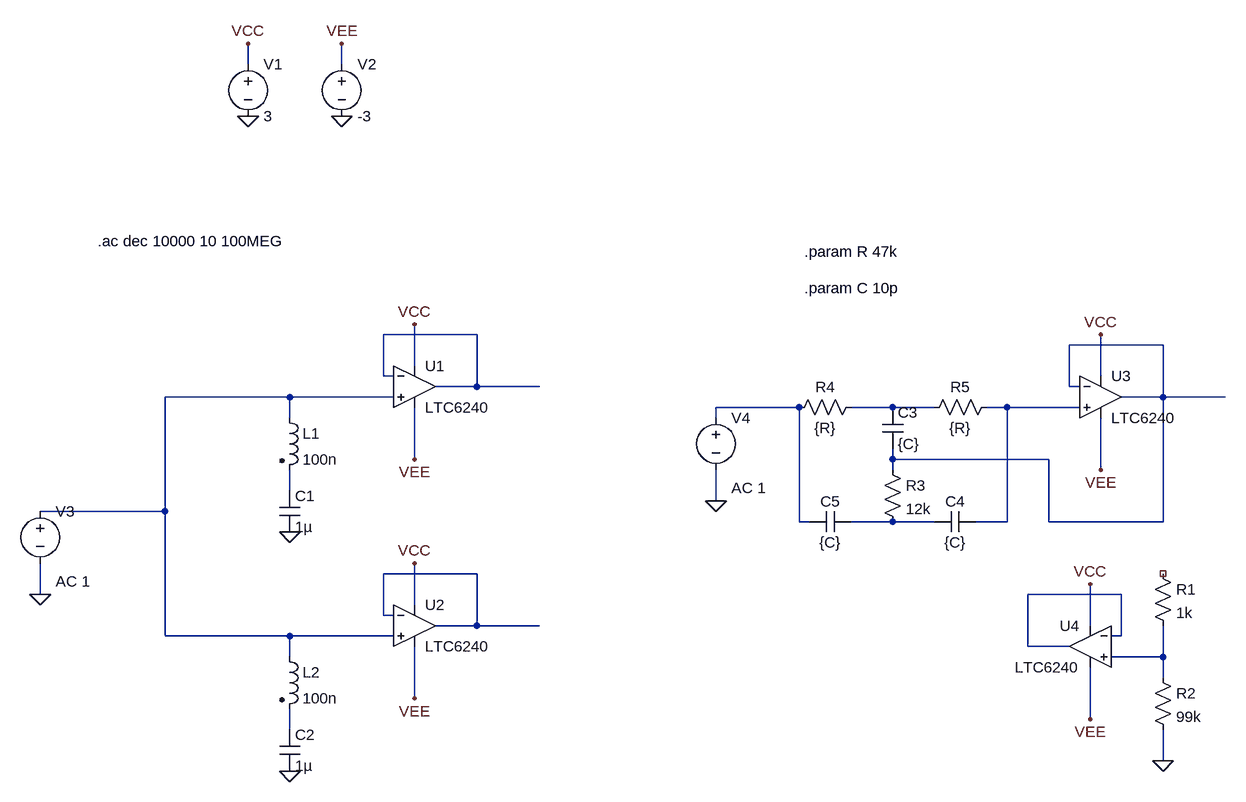
[diagram p0: schematic twin ‘‘T’’ network.asc]
twin ‘‘T’’ network.asc, the LTspice schematic file:
Version 4
SHEET 1 1608 680
WIRE 48 -512 48 -544
WIRE 192 -512 192 -544
WIRE 400 -96 256 -96
WIRE 1456 -80 1312 -80
WIRE 304 -48 304 -112
WIRE 256 -32 256 -96
WIRE 272 -32 256 -32
WIRE 1360 -32 1360 -96
WIRE 400 -16 400 -96
WIRE 400 -16 336 -16
WIRE 496 -16 400 -16
WIRE 1312 -16 1312 -80
WIRE 1328 -16 1312 -16
WIRE 112 0 -80 0
WIRE 272 0 112 0
WIRE 1456 0 1456 -80
WIRE 1456 0 1392 0
WIRE 1552 0 1456 0
WIRE 896 16 768 16
WIRE 1040 16 976 16
WIRE 1104 16 1040 16
WIRE 1216 16 1184 16
WIRE 1328 16 1216 16
WIRE 112 32 112 0
WIRE 768 32 768 16
WIRE 304 96 304 16
WIRE 1040 96 1040 80
WIRE 1280 96 1040 96
WIRE 1040 112 1040 96
WIRE 1360 112 1360 32
WIRE 112 144 112 112
WIRE 768 160 768 112
WIRE -80 176 -80 0
WIRE -80 176 -272 176
WIRE 896 192 896 16
WIRE 912 192 896 192
WIRE 1040 192 976 192
WIRE 1104 192 1040 192
WIRE 1216 192 1216 16
WIRE 1216 192 1168 192
WIRE 1280 192 1280 96
WIRE 1456 192 1456 0
WIRE 1456 192 1280 192
WIRE 400 272 256 272
WIRE -272 304 -272 256
WIRE 1392 304 1248 304
WIRE 304 320 304 256
WIRE 256 336 256 272
WIRE 272 336 256 336
WIRE 400 352 400 272
WIRE 400 352 336 352
WIRE 496 352 400 352
WIRE 1344 352 1344 288
WIRE -80 368 -80 176
WIRE 112 368 -80 368
WIRE 272 368 112 368
WIRE 1392 368 1392 304
WIRE 1392 368 1376 368
WIRE 1248 384 1248 304
WIRE 1312 384 1248 384
WIRE 112 400 112 368
WIRE 1456 400 1456 352
WIRE 1456 400 1376 400
WIRE 1456 432 1456 400
WIRE 304 464 304 384
WIRE 1344 496 1344 416
WIRE 112 512 112 480
WIRE 1456 560 1456 512
FLAG 48 -432 0
FLAG 192 -432 0
FLAG 48 -544 VCC
FLAG 192 -544 VEE
FLAG -272 304 0
FLAG 304 96 VEE
FLAG 304 -112 VCC
FLAG 112 208 0
FLAG 304 464 VEE
FLAG 304 256 VCC
FLAG 112 576 0
FLAG 1360 112 VEE
FLAG 1360 -96 VCC
FLAG 1344 496 VEE
FLAG 1344 288 VCC
FLAG 1456 560 0
FLAG 768 160 0
SYMBOL voltage 48 -528 R0
WINDOW 123 0 0 Left 0
WINDOW 39 0 0 Left 0
SYMATTR InstName V1
SYMATTR Value 3
SYMBOL voltage 192 -528 R0
WINDOW 123 0 0 Left 0
WINDOW 39 0 0 Left 0
SYMATTR InstName V2
SYMATTR Value -3
SYMBOL OpAmps\\LTC6240 304 -16 R0
SYMATTR InstName U1
SYMBOL voltage -272 160 R0
WINDOW 123 24 124 Left 2
WINDOW 39 0 0 Left 0
SYMATTR Value2 AC 1
SYMATTR InstName V3
SYMATTR Value ""
SYMBOL ind2 96 16 R0
SYMATTR InstName L1
SYMATTR Value 100n
SYMATTR Type ind
SYMBOL cap 96 144 R0
SYMATTR InstName C1
SYMATTR Value 1µ
SYMBOL OpAmps\\LTC6240 304 352 R0
SYMATTR InstName U2
SYMBOL ind2 96 384 R0
SYMATTR InstName L2
SYMATTR Value 100n
SYMATTR Type ind
SYMBOL cap 96 512 R0
SYMATTR InstName C2
SYMATTR Value 1µ
SYMBOL OpAmps\\LTC6240 1360 0 R0
SYMATTR InstName U3
SYMBOL OpAmps\\LTC6240 1344 384 M0
SYMATTR InstName U4
SYMBOL res 1440 256 R0
SYMATTR InstName R1
SYMATTR Value 1k
SYMBOL res 1440 416 R0
SYMATTR InstName R2
SYMATTR Value 99k
SYMBOL cap 1024 16 R0
SYMATTR InstName C3
SYMATTR Value {C}
SYMBOL res 1024 96 R0
SYMATTR InstName R3
SYMATTR Value 12k
SYMBOL res 992 0 R90
WINDOW 0 0 56 VBottom 2
WINDOW 3 32 56 VTop 2
SYMATTR InstName R4
SYMATTR Value {R}
SYMBOL res 1200 0 R90
WINDOW 0 0 56 VBottom 2
WINDOW 3 32 56 VTop 2
SYMATTR InstName R5
SYMATTR Value {R}
SYMBOL cap 1168 176 R90
WINDOW 0 0 32 VBottom 2
WINDOW 3 32 32 VTop 2
SYMATTR InstName C4
SYMATTR Value {C}
SYMBOL cap 976 176 R90
WINDOW 0 0 32 VBottom 2
WINDOW 3 32 32 VTop 2
SYMATTR InstName C5
SYMATTR Value {C}
SYMBOL voltage 768 16 R0
WINDOW 123 24 124 Left 2
WINDOW 39 0 0 Left 0
SYMATTR Value2 AC 1
SYMATTR InstName V4
SYMATTR Value ""
TEXT 904 -224 Left 2 !.param R 47k
TEXT 904 -168 Left 2 !.param C 10p
TEXT -184 -240 Left 2 !.ac dec 10000 10 100MEG

The netlist it stands for:
* twin ‘‘T’’ network.asc
V1 VCC 0 3
V2 VEE 0 -3
* U1: LTC6240 (symbol OpAmps\LTC6240 not available, pins judged from their places): In+=N003 In-=N001 V+=VCC V-=VEE OUT=N001
V3 N003 0 AC 1
L1 N003 N007 100n
C1 N007 0 1µ
* U2: LTC6240 (symbol OpAmps\LTC6240 not available, pins judged from their places): In+=N003 In-=N009 V+=VCC V-=VEE OUT=N009
L2 N003 N012 100n
C2 N012 0 1µ
* U3: LTC6240 (symbol OpAmps\LTC6240 not available, pins judged from their places): In+=N006 In-=N002 V+=VCC V-=VEE OUT=N002
* U4: LTC6240 (symbol OpAmps\LTC6240 not available, pins judged from their places): In+=N011 In-=N010 V+=VCC V-=VEE OUT=N010
R1 NC_01 N011 1k
R2 N011 0 99k
C3 N005 N002 {C}
R3 N002 N008 12k
R4 N005 N004 {R}
R5 N006 N005 {R}
C4 N006 N008 {C}
C5 N008 N004 {C}
V4 N004 0 AC 1
.param R 47k
.param C 10p
.ac dec 10000 10 100MEG
.backanno
.end